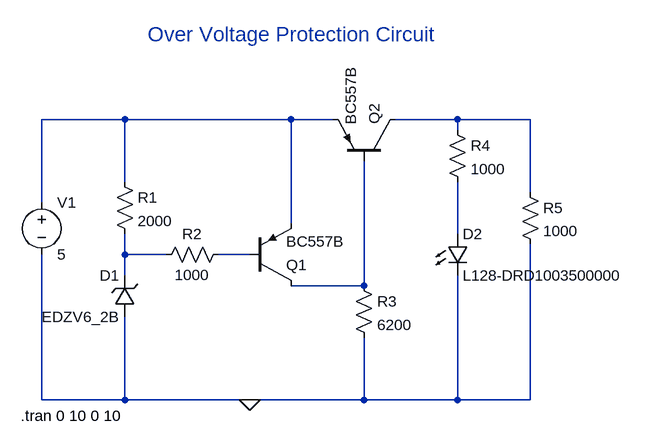
[diagram p0: schematic Over_Voltage_Protection_Circuit.asc]
Over_Voltage_Protection_Circuit.asc, the LTspice schematic file:
Version 4
SHEET 1 900 680
WIRE 112 -160 -16 -160
WIRE 368 -160 112 -160
WIRE 432 -160 368 -160
WIRE 624 -160 528 -160
WIRE 736 -160 624 -160
WIRE 624 -144 624 -160
WIRE 112 -64 112 -160
WIRE 736 -48 736 -160
WIRE -16 -32 -16 -160
WIRE 368 0 368 -160
WIRE 624 16 624 -64
WIRE 112 48 112 16
WIRE 176 48 112 48
WIRE 304 48 256 48
WIRE 112 80 112 48
WIRE 480 96 480 -96
WIRE 480 96 368 96
WIRE -16 272 -16 48
WIRE 112 272 112 144
WIRE 112 272 -16 272
WIRE 304 272 112 272
WIRE 480 272 480 176
WIRE 480 272 304 272
WIRE 624 272 624 80
WIRE 624 272 480 272
WIRE 736 272 736 32
WIRE 736 272 624 272
FLAG 304 272 0
SYMBOL res 96 -80 R0
SYMATTR InstName R1
SYMATTR Value 2000
SYMBOL voltage -16 -48 R0
WINDOW 123 0 0 Left 0
WINDOW 39 0 0 Left 0
SYMATTR InstName V1
SYMATTR Value 5
SYMBOL zener 128 144 R180
WINDOW 0 24 64 Left 2
WINDOW 3 24 0 Left 2
SYMATTR InstName D1
SYMATTR Value EDZV6_2B
SYMBOL res 272 32 R90
WINDOW 0 0 56 VBottom 2
WINDOW 3 32 56 VTop 2
SYMATTR InstName R2
SYMATTR Value 1000
SYMBOL pnp 304 96 M180
SYMATTR InstName Q1
SYMATTR Value BC557B
SYMBOL pnp 528 -96 M270
SYMATTR InstName Q2
SYMATTR Value BC557B
SYMBOL res 464 80 R0
SYMATTR InstName R3
SYMATTR Value 6200
SYMBOL res 608 -160 R0
SYMATTR InstName R4
SYMATTR Value 1000
SYMBOL res 720 -64 R0
SYMATTR InstName R5
SYMATTR Value 1000
SYMBOL LED 608 16 R0
SYMATTR InstName D2
SYMATTR Value L128-DRD1003500000
TEXT 368 -312 Top 3 ;Over Voltage Protection Circuit
TEXT -48 296 Left 2 !.tran 0 10 0 10

The netlist it stands for:
* Over_Voltage_Protection_Circuit.asc
R1 N001 N004 2000
V1 N001 0 5
D1 0 N004 EDZV6_2B
R2 N005 N004 1000
Q1 N006 N005 N001 0 BC557B
Q2 N002 N006 N001 0 BC557B
R3 N006 0 6200
R4 N002 N003 1000
R5 N002 0 1000
D2 N003 0 L128-DRD1003500000
.model D D
.lib standard.dio
.model NPN NPN
.model PNP PNP
.lib standard.bjt
* Over Voltage Protection Circuit
.tran 0 10 0 10
.backanno
.end